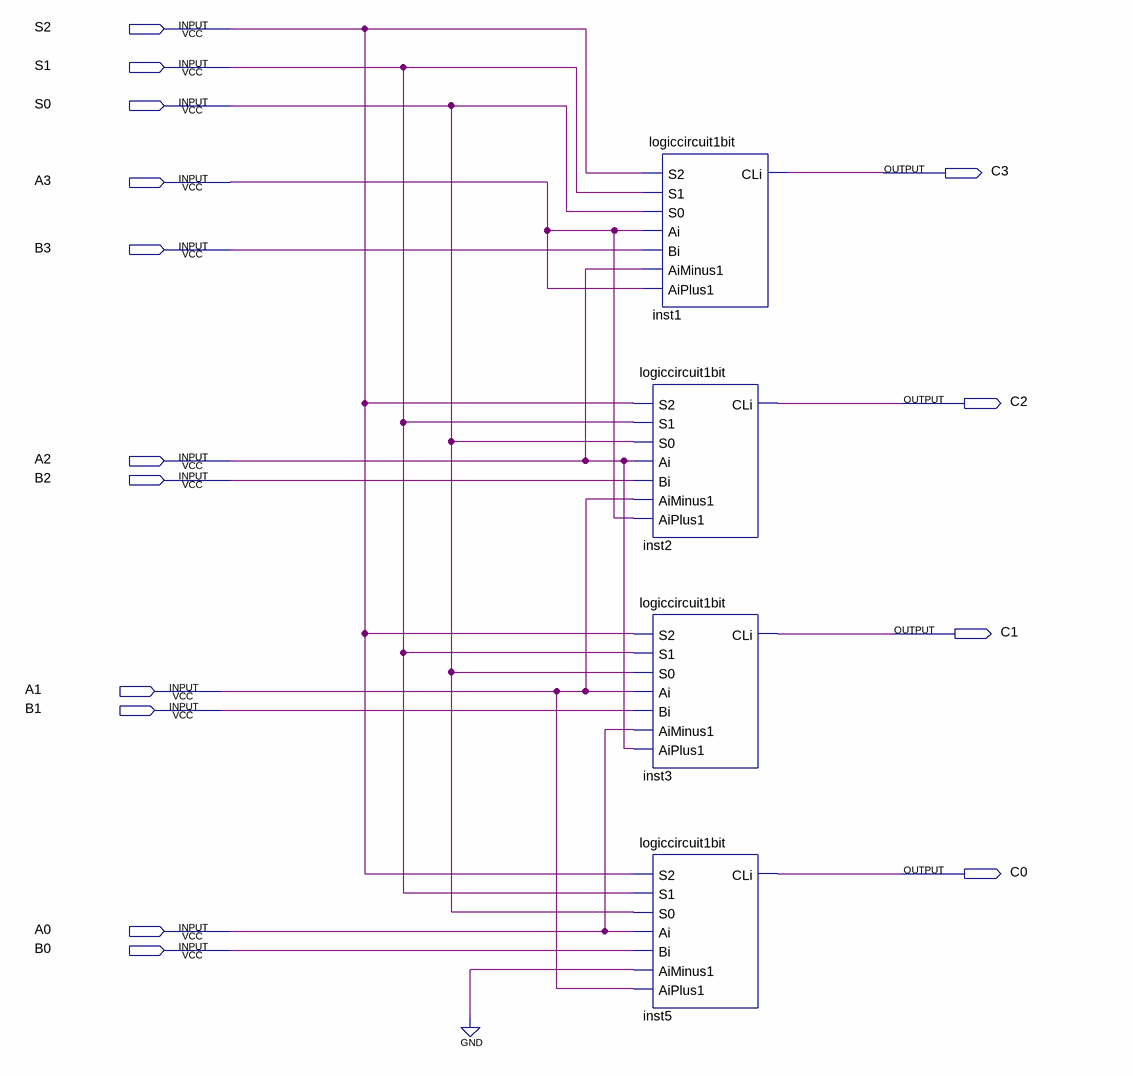
[diagram p0: schematic sheet]
// Quartus schematic logiccircuit4bits.bdf as structural Verilog: 4 symbols, 15 pins
module logiccircuit4bits (
  input  S2,
  input  S1,
  input  S0,
  input  A3,
  input  B3,
  input  A2,
  input  B2,
  input  A1,
  input  B1,
  input  A0,
  input  B0,
  output C3,
  output C2,
  output C1,
  output C0
);

  logiccircuit1bit inst1 (.S2(S2), .S1(S1), .S0(S0), .Ai(A3), .Bi(B3), .AiMinus1(A2), .AiPlus1(A3), .CLi(C3));
  logiccircuit1bit inst2 (.S2(S2), .S1(S1), .S0(S0), .Ai(A2), .Bi(B2), .AiMinus1(A1), .AiPlus1(A3), .CLi(C2));
  logiccircuit1bit inst3 (.S2(S2), .S1(S1), .S0(S0), .Ai(A1), .Bi(B1), .AiMinus1(A0), .AiPlus1(A2), .CLi(C1));
  logiccircuit1bit inst5 (.S2(S2), .S1(S1), .S0(S0), .Ai(A0), .Bi(B0), .AiMinus1(1'b0), .AiPlus1(A1), .CLi(C0));
endmodule
